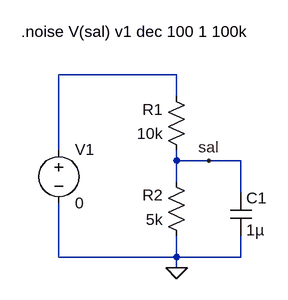
[diagram p0: schematic noise2.asc]
noise2.asc, the LTspice schematic file:
Version 4
SHEET 1 880 680
WIRE 208 32 32 32
WIRE 208 64 208 32
WIRE 32 144 32 32
WIRE 208 160 208 144
WIRE 256 160 208 160
WIRE 304 160 256 160
WIRE 208 192 208 160
WIRE 304 208 304 160
WIRE 32 304 32 224
WIRE 208 304 208 272
WIRE 208 304 32 304
WIRE 304 304 304 272
WIRE 304 304 208 304
WIRE 208 320 208 304
FLAG 208 320 0
FLAG 256 160 sal
SYMBOL voltage 32 128 R0
WINDOW 123 0 0 Left 0
WINDOW 39 0 0 Left 0
SYMATTR InstName V1
SYMATTR Value 0
SYMBOL res 224 160 R180
WINDOW 0 36 76 Left 2
WINDOW 3 36 40 Left 2
SYMATTR InstName R1
SYMATTR Value 10k
SYMBOL res 224 288 R180
WINDOW 0 36 76 Left 2
WINDOW 3 36 40 Left 2
SYMATTR InstName R2
SYMATTR Value 5k
SYMBOL cap 288 208 R0
SYMATTR InstName C1
SYMATTR Value 1µ
TEXT -24 -32 Left 2 !.noise V(sal) v1 dec 100 1 100k

The netlist it stands for:
* noise2.asc
V1 N001 0 0
R1 sal N001 10k
R2 0 sal 5k
C1 sal 0 1µ
.noise V(sal) v1 dec 100 1 100k
.backanno
.end